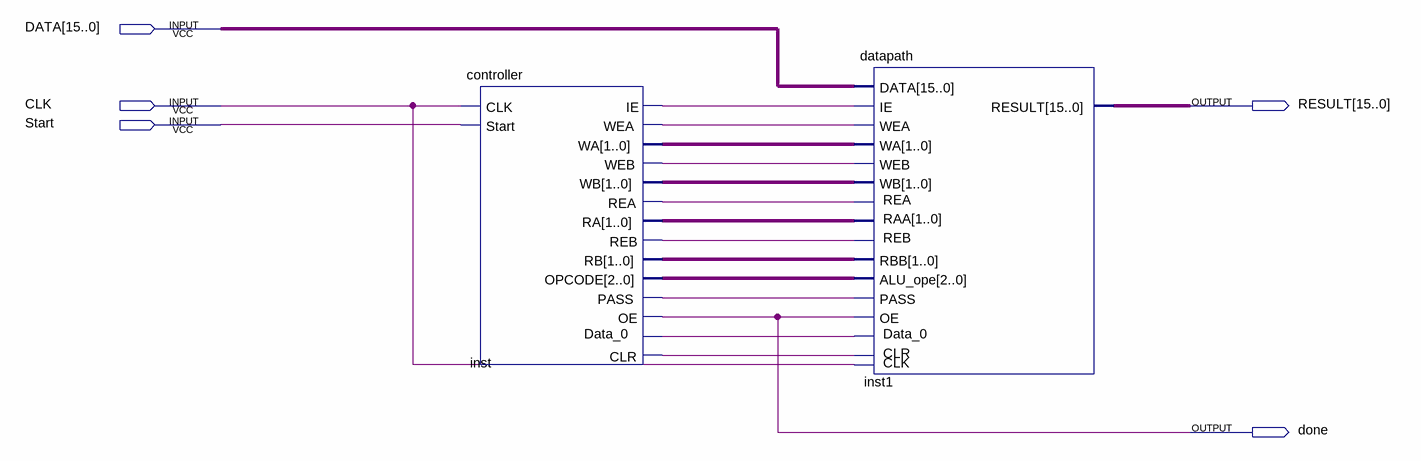
[diagram p0: schematic sheet]
// Quartus schematic Lab5_3.bdf as structural Verilog: 2 symbols, 5 pins
module Lab5_3 (
  input  [15:0] DATA,
  input  CLK,
  input  Start,
  output [15:0] RESULT,
  output done
);

  wire inst1_data_0, inst_clr, inst_ie, inst_pass, inst_rea, inst_reb, inst_wea, inst_web;
  wire [1:0] inst_ra, inst_rb, inst_wa, inst_wb;
  wire [2:0] inst_opcode;

  controller inst (
    .CLK(CLK), .Start(Start), .Data_0(inst1_data_0), .IE(inst_ie), .WEA(inst_wea), .WA(inst_wa),
    .WEB(inst_web), .WB(inst_wb), .REA(inst_rea), .RA(inst_ra), .REB(inst_reb), .RB(inst_rb),
    .OPCODE(inst_opcode), .PASS(inst_pass), .OE(done), .CLR(inst_clr));
  datapath inst1 (
    .DATA(DATA), .IE(inst_ie), .REA(inst_rea), .RAA(inst_ra), .WEA(inst_wea), .WA(inst_wa), .REB(inst_reb),
    .WEB(inst_web), .RBB(inst_rb), .WB(inst_wb), .CLK(CLK), .CLR(inst_clr), .ALU_ope(inst_opcode),
    .PASS(inst_pass), .OE(done), .Data_0(inst1_data_0), .RESULT(RESULT));
endmodule
